# EAGLE design H00R20 (EAGLE 9.2.2)
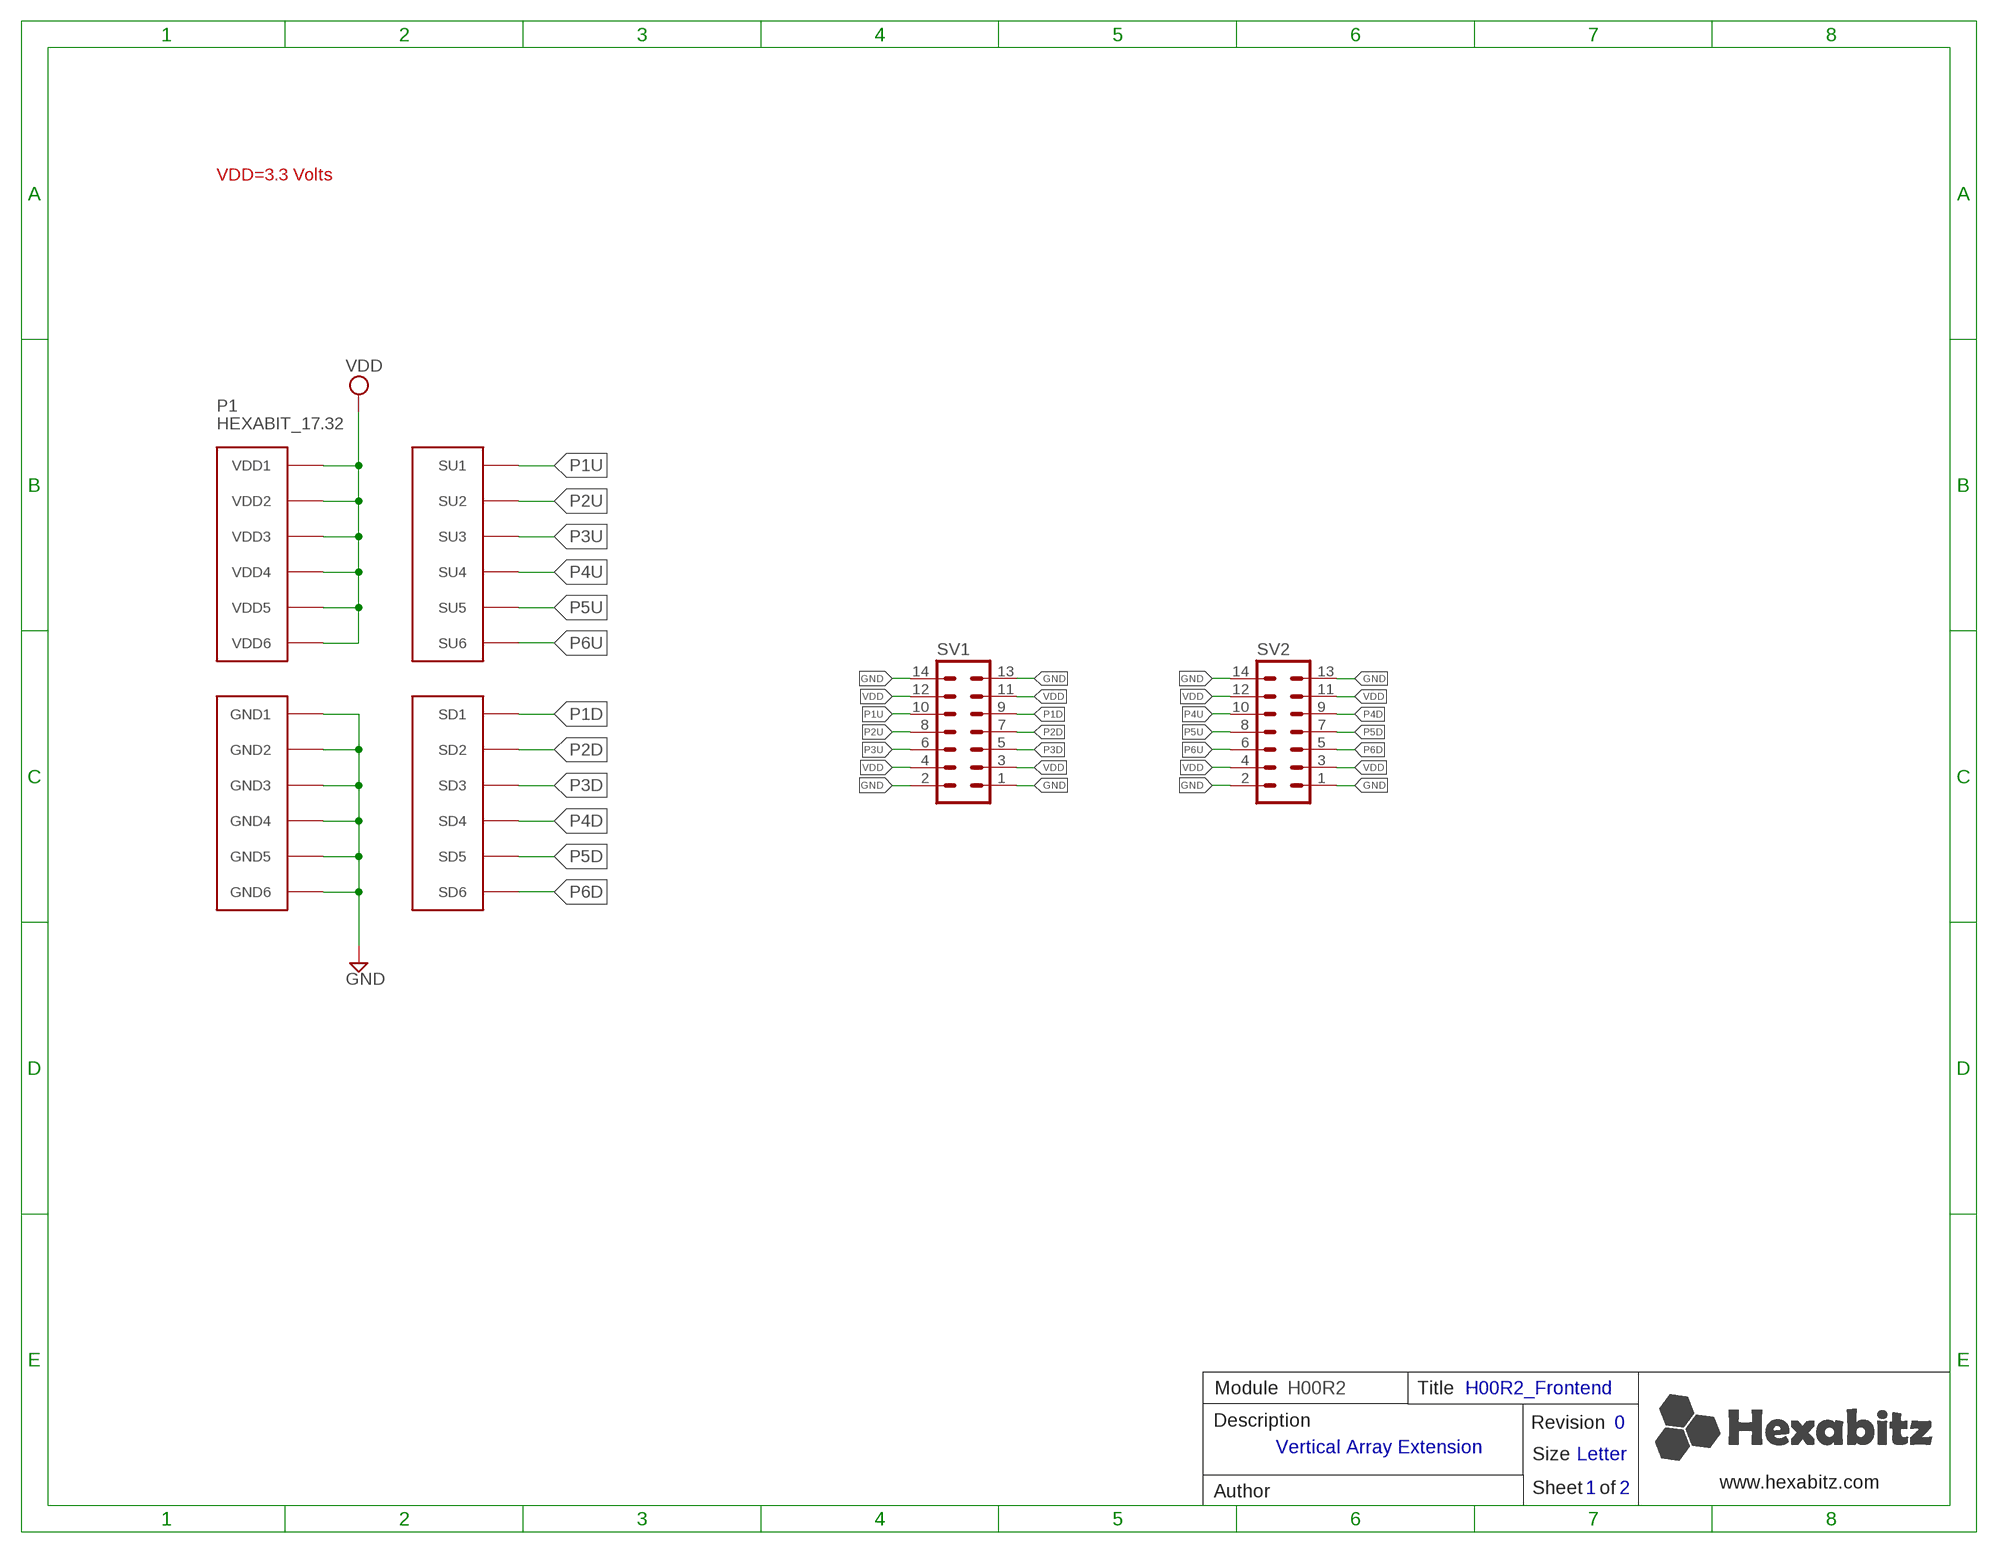
[diagram p0: schematic, sheet 1]

## Parts
P1  HEXABIT_17.32  [HEXABIT_17.32]
SV1  MA07-2  [MA07-2]
SV2  MA07-2  [MA07-2]

## Nets
GND: P1.PAD_PD7(GND1) P1.PAD_PD8(GND2) P1.PAD_PD9(GND3) P1.PAD_PD10(GND4) P1.PAD_PD11(GND5) P1.PAD_PD12(GND6) SV1.1 SV1.2 SV1.13 SV1.14 SV2.1 SV2.2 SV2.13 SV2.14
P1D: P1.PAD_PD1(SD1) SV1.9
P1U: P1.PAD_PU1(SU1) SV1.10
P2D: P1.PAD_PD2(SD2) SV1.7
P2U: P1.PAD_PU2(SU2) SV1.8
P3D: P1.PAD_PD3(SD3) SV1.5
P3U: P1.PAD_PU3(SU3) SV1.6
P4D: P1.PAD_PD4(SD4) SV2.9
P4U: P1.PAD_PU4(SU4) SV2.10
P5D: P1.PAD_PD5(SD5) SV2.7
P5U: P1.PAD_PU5(SU5) SV2.8
P6D: P1.PAD_PD6(SD6) SV2.5
P6U: P1.PAD_PU6(SU6) SV2.6
VDD: P1.PAD_PU7(VDD1) P1.PAD_PU8(VDD2) P1.PAD_PU9(VDD3) P1.PAD_PU10(VDD4) P1.PAD_PU11(VDD5) P1.PAD_PU12(VDD6) SV1.3 SV1.4 SV1.11 SV1.12 SV2.3 SV2.4 SV2.11 SV2.12

## Notes on the sheet
- VDD=3.3 Volts
- Module | H00R2 | Title | H00R2_Frontend
- Description | Revision | 0
- Vertical Array Extension
- Size | Letter
- www.hexabitz.com
- Author | Sheet   of | 1 | 2

## Library data of the parts
P1 = hexabitz_connectors:HEXABIT_?: Hexabitz Hexagon Module Connector Hexagon side length = 17.32mm.
SV1 SV2 = Hexabitz:MA07-2: PIN HEADER; OC_FARNELL: unknown; OC_NEWARK: unknown

## Board
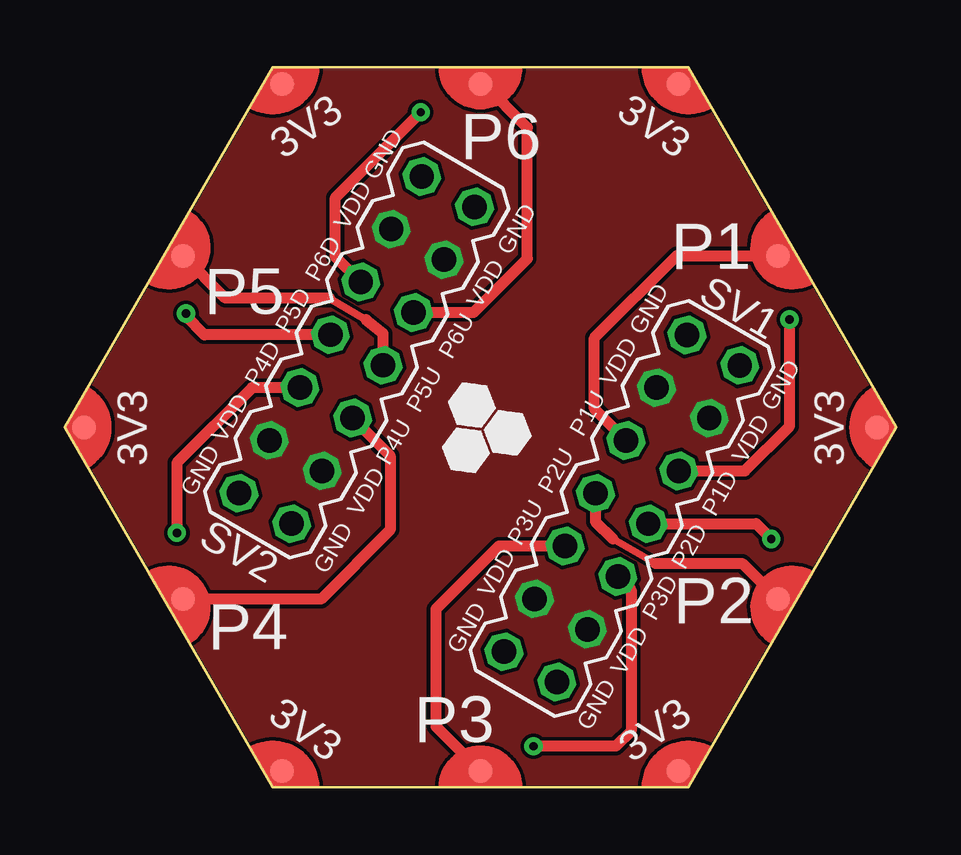
[diagram p1: board, top side]
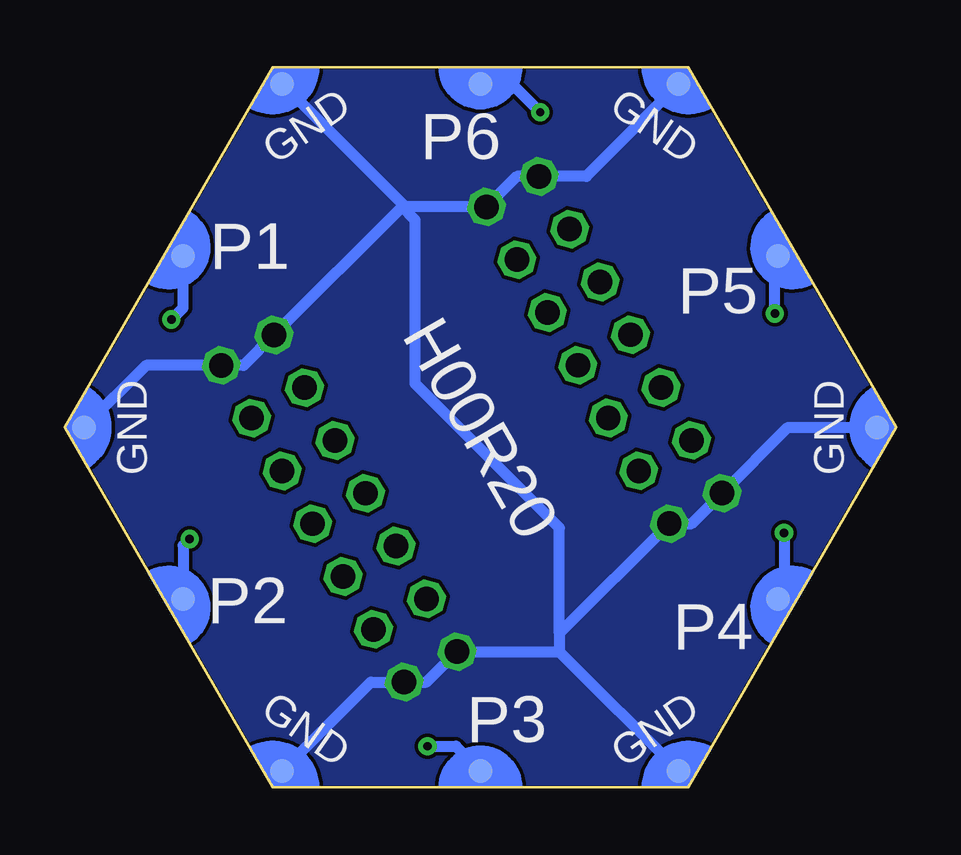
[diagram p2: board, bottom side, seen from below]

Size 34.64 x 30 mm. Coordinates in mm from the lower left corner, seen from the top.
Copper layers (1*16): Top 0.035mm / dielectric 1.5mm / Bottom 0.035mm
Design rules "2_layer": minimum track width 7mil, minimum drill 10mil, track to track 6mil, track to pad 6mil, pad to pad 6mil, via to via 6mil, smd to smd 0mil, copper to edge 1mil, drill to drill 8mil, minimum pad ring 10mil, minimum via ring 8mil, stop-mask expansion 2mil, vias tented up to drill 15mil, thermal gap 10mil

### Footprints (pad centres in the part's own frame; a part is rotated, then mirrored left to right if it is on the bottom)
HEXABIT_17.32 = smd 1 x 1 bottom: PAD_PD1 12.39,7.15; PAD_PD2 12.39,-7.15; PAD_PD3 0,-14.31; PAD_PD4 -12.39,-7.15; PAD_PD5 -12.39,7.15; PAD_PD6 0,14.31; PAD_PD7 8.26,14.31; PAD_PD8 16.52,0; PAD_PD9 8.26,-14.31; PAD_PD10 -8.26,-14.31; PAD_PD11 -16.52,0; PAD_PD12 -8.26,14.31 | smd 1 x 1: PAD_PU1 12.39,7.15; PAD_PU2 12.39,-7.15; PAD_PU3 0,-14.31; PAD_PU4 -12.39,-7.15; PAD_PU5 -12.39,7.15; PAD_PU6 0,14.31; PAD_PU7 8.26,14.31; PAD_PU8 16.52,0; PAD_PU9 8.26,-14.31; PAD_PU10 -8.26,-14.31; PAD_PU11 -16.52,0; PAD_PU12 -8.26,14.31
MA07-2 = drill 1.016 octagon: 1 -7.62,-1.27; 2 -7.62,1.27; 3 -5.08,-1.27; 4 -5.08,1.27; 5 -2.54,-1.27; 6 -2.54,1.27; 7 0,-1.27; 8 0,1.27; 9 2.54,-1.27; 10 2.54,1.27; 11 5.08,-1.27; 12 5.08,1.27; 13 7.62,-1.27; 14 7.62,1.27

### Placement (x,y rotation side)
P1  17.32,15 0 top
SV1  23.21,11.62 60 top
SV2  12.16,18.23 240 top

### Tracks (layer width: path | path; a pad name or v marks a point on that pad's centre or on a via)
GND
  Bottom 0.457: P1.PAD_PD12 12.91,25.46 SV2.1 15.8,25.46 SV2.2 20.46,24.19 | 20.46,24.19 P1.PAD_PD7 | 20.59,24.19 SV1.14 27.19,17.59 SV1.13 31.25,17.59 P1.PAD_PD8 | 20.59,24.19 20.46,24.19 | P1.PAD_PD9 21.88,4.39 SV1.1 19.57,4.39 SV1.2 14.03,5.66 | 14.03,5.66 P1.PAD_PD10 | 14.03,6.42 SV2.14 8.52,10.99 SV2.13 4.52,15 P1.PAD_PD11 | 14.03,6.42 14.03,5.66 | 14.03,6.42 14.03,10.82 20.04,16.83 20.04,23.64 20.59,24.19
  pour Bottom (no thermals): 8.66,0 25.98,0 34.64,15 25.98,30 8.66,30 0,15
N$1
  pour Top: 8.73,29.78 25.88,29.78 34.39,15.05 25.88,0.19 8.73,0.19 0.23,15.05
P1D  (via drill 0.35)
  Top 0.457: SV1.9 28.33,13.19 30.2,15.05 v30.2,19.5
  Bottom 0.457: v30.2,19.5 29.71,19.98 P1.PAD_PD1
P1U
  Top 0.457: SV1.10 22.07,15.77 22.07,18.73 25.5,22.16 29.7,22.16 P1.PAD_PU1
P2D  (via drill 0.35)
  Top 0.457: SV1.7 28.8,10.99 v29.44,10.35
  Bottom 0.457: v29.44,10.35 29.71,10.08 P1.PAD_PD2
P2U
  Top 0.305: 22.83,10.35 24.61,9.34
  Top 0.457: SV1.8 22.11,11.07 22.83,10.35 | 24.61,9.34 28.22,9.34 P1.PAD_PU2
P3D  (via drill 0.35)
  Top 0.457: SV1.5 23.59,8.24 23.59,2.35 22.96,1.72 v19.53,1.72
  Bottom 0.457: v19.53,1.72 18.35,1.72 P1.PAD_PD3
P3U
  Top 0.457: SV1.6 18.09,10.06 15.47,7.43 15.47,2.54 P1.PAD_PU3
P4D  (via drill 0.35)
  Top 0.457: SV2.9 7.8,16.66 4.67,13.53 v4.67,10.61
  Bottom 0.457: v4.67,10.61 4.67,8.11 P1.PAD_PD4
P4U
  Top 0.457: SV2.10 13.56,13.82 13.56,10.73 10.68,7.85 P1.PAD_PU4
P5D  (via drill 0.35)
  Top 0.457: SV2.7 5.81,18.86 5.05,19.62 v5.05,19.75
  Bottom 0.457: v5.05,19.75 5.05,22.03 P1.PAD_PD5
P5U
  Top 0.305: 12.54,19.5 11.02,20.38
  Top 0.457: SV2.8 13.26,18.9 12.54,19.5 | 11.02,20.38 6.69,20.38 P1.PAD_PU5
P6D  (via drill 0.35)
  Top 0.457: SV2.5 11.27,22.12 11.27,24.58 v14.83,28.13
  Bottom 0.457: v14.83,28.13 16.01,29.31 P1.PAD_PD6
P6U
  Top 0.457: SV2.6 17.03,19.79 19.28,22.04 19.28,27.5 17.46,29.31 P1.PAD_PU6
VDD
  pour Top (no thermals): 8.66,0 25.98,0 34.64,15 25.98,30 8.66,30 0,15

### Text on the board
tPlace: 3V3 | P6 | 3V3 | P1 | P5 | 3V3 | 3V3 | P2 | P4 | 3V3 | P3 | 3V3
bPlace: GND | P6 | GND | P1 | P5 | GND | H00R20 | GND | P2 | P4 | GND | P3 | GND
tNames: GND | VDD | GND | P6D | VDD | P5D | GND | P6U | P4D | VDD | P5U | GND | VDD | P1U | P4U | VDD | GND | P2U | VDD | P1D | P3U | P2D | GND | VDD | P3D | GND | VDD | GND